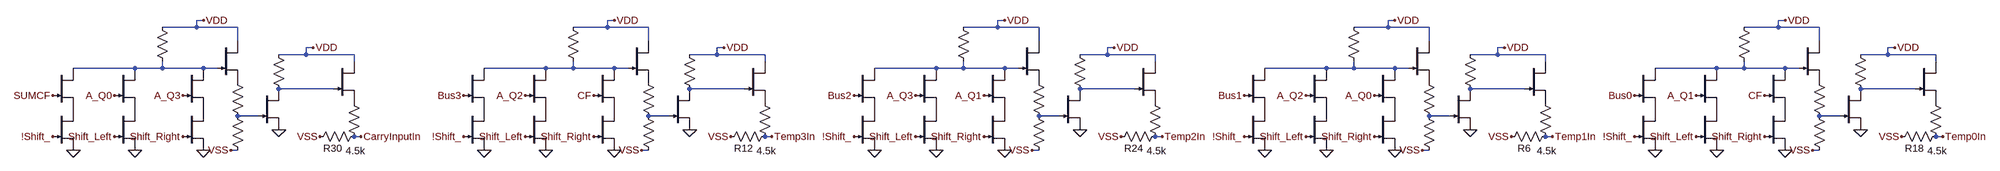
[diagram p0: schematic 4 bit.asc]
4 bit.asc, the LTspice schematic file:
Version 4.1
SHEET 1 109444 42780
WIRE -4192 4224 -4208 4224
WIRE -3232 4224 -3248 4224
WIRE -2320 4224 -2336 4224
WIRE -1408 4224 -1424 4224
WIRE -496 4224 -512 4224
WIRE -4208 4240 -4208 4224
WIRE -4208 4240 -4288 4240
WIRE -4112 4240 -4208 4240
WIRE -3248 4240 -3248 4224
WIRE -3248 4240 -3328 4240
WIRE -3152 4240 -3248 4240
WIRE -2336 4240 -2336 4224
WIRE -2336 4240 -2416 4240
WIRE -2240 4240 -2336 4240
WIRE -1424 4240 -1424 4224
WIRE -1424 4240 -1504 4240
WIRE -1328 4240 -1424 4240
WIRE -512 4240 -512 4224
WIRE -512 4240 -592 4240
WIRE -416 4240 -512 4240
WIRE -4112 4272 -4112 4240
WIRE -3152 4272 -3152 4240
WIRE -2240 4272 -2240 4240
WIRE -1328 4272 -1328 4240
WIRE -416 4272 -416 4240
WIRE -3936 4288 -3952 4288
WIRE -2976 4288 -2992 4288
WIRE -2064 4288 -2080 4288
WIRE -1152 4288 -1168 4288
WIRE -240 4288 -256 4288
WIRE -3952 4304 -3952 4288
WIRE -3952 4304 -4016 4304
WIRE -3840 4304 -3952 4304
WIRE -2992 4304 -2992 4288
WIRE -2992 4304 -3056 4304
WIRE -2880 4304 -2992 4304
WIRE -2080 4304 -2080 4288
WIRE -2080 4304 -2144 4304
WIRE -1968 4304 -2080 4304
WIRE -1168 4304 -1168 4288
WIRE -1168 4304 -1232 4304
WIRE -1056 4304 -1168 4304
WIRE -256 4304 -256 4288
WIRE -256 4304 -320 4304
WIRE -144 4304 -256 4304
WIRE -3840 4320 -3840 4304
WIRE -2880 4320 -2880 4304
WIRE -1968 4320 -1968 4304
WIRE -1056 4320 -1056 4304
WIRE -144 4320 -144 4304
WIRE -4352 4336 -4496 4336
WIRE -4288 4336 -4288 4320
WIRE -4288 4336 -4352 4336
WIRE -4192 4336 -4288 4336
WIRE -4160 4336 -4192 4336
WIRE -3392 4336 -3536 4336
WIRE -3328 4336 -3328 4320
WIRE -3328 4336 -3392 4336
WIRE -3232 4336 -3328 4336
WIRE -3200 4336 -3232 4336
WIRE -2480 4336 -2624 4336
WIRE -2416 4336 -2416 4320
WIRE -2416 4336 -2480 4336
WIRE -2320 4336 -2416 4336
WIRE -2288 4336 -2320 4336
WIRE -1568 4336 -1712 4336
WIRE -1504 4336 -1504 4320
WIRE -1504 4336 -1568 4336
WIRE -1408 4336 -1504 4336
WIRE -1376 4336 -1408 4336
WIRE -656 4336 -800 4336
WIRE -592 4336 -592 4320
WIRE -592 4336 -656 4336
WIRE -496 4336 -592 4336
WIRE -464 4336 -496 4336
WIRE -3888 4384 -4016 4384
WIRE -2928 4384 -3056 4384
WIRE -2016 4384 -2144 4384
WIRE -1104 4384 -1232 4384
WIRE -192 4384 -320 4384
WIRE -4064 4448 -4112 4448
WIRE -3104 4448 -3152 4448
WIRE -2192 4448 -2240 4448
WIRE -1280 4448 -1328 4448
WIRE -368 4448 -416 4448
WIRE -3824 4496 -3840 4496
WIRE -2864 4496 -2880 4496
WIRE -1952 4496 -1968 4496
WIRE -1040 4496 -1056 4496
WIRE -128 4496 -144 4496
WIRE -4112 4528 -4128 4528
WIRE -3152 4528 -3168 4528
WIRE -2240 4528 -2256 4528
WIRE -1328 4528 -1344 4528
WIRE -416 4528 -432 4528
FLAG -2320 4528 0
FLAG -2480 4528 0
FLAG -2144 4480 0
FLAG -2320 4224 VDD
FLAG -2064 4288 VDD
FLAG -2256 4528 VSS
FLAG -2048 4496 VSS
FLAG -2528 4496 Shift_Left
FLAG -2368 4496 Shift_Right
FLAG -2624 4528 0
FLAG -2672 4496 !Shift_
FLAG -2672 4400 Bus2
FLAG -2528 4400 A_Q3
FLAG -4192 4528 0
FLAG -4352 4528 0
FLAG -4016 4480 0
FLAG -4192 4224 VDD
FLAG -3936 4288 VDD
FLAG -4128 4528 VSS
FLAG -3920 4496 VSS
FLAG -4400 4496 Shift_Left
FLAG -4240 4496 Shift_Right
FLAG -4496 4528 0
FLAG -4544 4496 !Shift_
FLAG -4240 4400 A_Q3
FLAG -1952 4496 Temp2In
FLAG -3824 4496 CarryInputIn
FLAG -4544 4400 SUMCF
FLAG -4400 4400 A_Q0
FLAG -1408 4528 0
FLAG -1568 4528 0
FLAG -1232 4480 0
FLAG -1408 4224 VDD
FLAG -1152 4288 VDD
FLAG -1344 4528 VSS
FLAG -1136 4496 VSS
FLAG -1616 4496 Shift_Left
FLAG -1456 4496 Shift_Right
FLAG -1712 4528 0
FLAG -1760 4496 !Shift_
FLAG -1760 4400 Bus1
FLAG -1616 4400 A_Q2
FLAG -1040 4496 Temp1In
FLAG -1456 4400 A_Q0
FLAG -2368 4400 A_Q1
FLAG -496 4528 0
FLAG -656 4528 0
FLAG -320 4480 0
FLAG -496 4224 VDD
FLAG -240 4288 VDD
FLAG -432 4528 VSS
FLAG -224 4496 VSS
FLAG -704 4496 Shift_Left
FLAG -544 4496 Shift_Right
FLAG -800 4528 0
FLAG -848 4496 !Shift_
FLAG -848 4400 Bus0
FLAG -704 4400 A_Q1
FLAG -128 4496 Temp0In
FLAG -544 4400 CF
FLAG -3232 4528 0
FLAG -3392 4528 0
FLAG -3056 4480 0
FLAG -3232 4224 VDD
FLAG -2976 4288 VDD
FLAG -3168 4528 VSS
FLAG -2960 4496 VSS
FLAG -3440 4496 Shift_Left
FLAG -3280 4496 Shift_Right
FLAG -3536 4528 0
FLAG -3584 4496 !Shift_
FLAG -3584 4400 Bus3
FLAG -3440 4400 A_Q2
FLAG -2864 4496 Temp3In
FLAG -3280 4400 CF
SYMBOL njf -2528 4336 R0
WINDOW 3 198 224 Invisible 2
WINDOW 0 56 32 Invisible 2
SYMATTR Value DR
SYMATTR InstName J_A19
SYMBOL res -2432 4224 R0
WINDOW 0 -35 57 Invisible 2
WINDOW 3 34 56 Invisible 2
SYMATTR InstName R19
SYMATTR Value 100k
SYMBOL njf -2288 4272 R0
WINDOW 0 56 32 Invisible 2
WINDOW 3 56 72 Invisible 2
SYMATTR InstName J_F4
SYMATTR Value DR
SYMBOL res -2256 4352 R0
WINDOW 0 -136 215 Invisible 2
WINDOW 3 34 58 Invisible 2
SYMATTR InstName R20
SYMATTR Value 1k
SYMBOL res -2256 4432 R0
WINDOW 0 -10 158 Invisible 2
WINDOW 3 37 62 Invisible 2
SYMATTR InstName R21
SYMATTR Value 4.8k
SYMBOL njf -2368 4336 R0
WINDOW 0 56 32 Invisible 2
WINDOW 3 56 72 Invisible 2
SYMATTR InstName J_B7
SYMATTR Value DR
SYMBOL njf -2192 4384 R0
WINDOW 0 56 32 Invisible 2
WINDOW 3 56 72 Invisible 2
SYMATTR InstName J_A20
SYMATTR Value DR
SYMBOL res -2160 4288 R0
WINDOW 0 56 32 Invisible 2
WINDOW 3 56 72 Invisible 2
SYMATTR InstName R22
SYMATTR Value 50k
SYMBOL njf -2016 4320 R0
WINDOW 0 56 32 Invisible 2
WINDOW 3 56 72 Invisible 2
SYMATTR InstName J_A21
SYMATTR Value DR
SYMBOL res -1984 4400 R0
WINDOW 0 37 24 Invisible 2
WINDOW 3 -30 25 Invisible 2
SYMATTR InstName R23
SYMATTR Value 1k
SYMBOL res -1952 4480 R90
WINDOW 0 59 66 VBottom 2
WINDOW 3 34 13 VTop 2
SYMATTR InstName R24
SYMATTR Value 4.5k
SYMBOL njf -2528 4432 R0
WINDOW 0 119 134 Invisible 2
WINDOW 3 131 136 Invisible 2
SYMATTR InstName J_A22
SYMATTR Value DR
SYMBOL njf -2368 4432 R0
WINDOW 3 -27 143 Invisible 2
WINDOW 0 56 32 Invisible 2
SYMATTR Value DR
SYMATTR InstName J_B8
SYMBOL njf -2672 4336 R0
WINDOW 0 63 15 Invisible 2
WINDOW 3 62 106 Invisible 2
SYMATTR InstName J_A23
SYMATTR Value DR
SYMBOL njf -2672 4432 R0
WINDOW 0 254 138 Invisible 2
WINDOW 3 277 142 Invisible 2
SYMATTR InstName J_A24
SYMATTR Value DR
SYMBOL njf -4400 4336 R0
WINDOW 3 198 224 Invisible 2
WINDOW 0 56 32 Invisible 2
SYMATTR Value DR
SYMATTR InstName J_A25
SYMBOL res -4304 4224 R0
WINDOW 0 -35 57 Invisible 2
WINDOW 3 34 56 Invisible 2
SYMATTR InstName R25
SYMATTR Value 100k
SYMBOL njf -4160 4272 R0
WINDOW 0 56 32 Invisible 2
WINDOW 3 56 72 Invisible 2
SYMATTR InstName J_F5
SYMATTR Value DR
SYMBOL res -4128 4352 R0
WINDOW 0 -136 215 Invisible 2
WINDOW 3 34 58 Invisible 2
SYMATTR InstName R26
SYMATTR Value 1k
SYMBOL res -4128 4432 R0
WINDOW 0 -10 158 Invisible 2
WINDOW 3 37 62 Invisible 2
SYMATTR InstName R27
SYMATTR Value 4.8k
SYMBOL njf -4240 4336 R0
WINDOW 0 56 32 Invisible 2
WINDOW 3 56 72 Invisible 2
SYMATTR InstName J_B9
SYMATTR Value DR
SYMBOL njf -4064 4384 R0
WINDOW 0 56 32 Invisible 2
WINDOW 3 56 72 Invisible 2
SYMATTR InstName J_A26
SYMATTR Value DR
SYMBOL res -4032 4288 R0
WINDOW 0 56 32 Invisible 2
WINDOW 3 56 72 Invisible 2
SYMATTR InstName R28
SYMATTR Value 50k
SYMBOL njf -3888 4320 R0
WINDOW 0 56 32 Invisible 2
WINDOW 3 56 72 Invisible 2
SYMATTR InstName J_A27
SYMATTR Value DR
SYMBOL res -3856 4400 R0
WINDOW 0 37 24 Invisible 2
WINDOW 3 -30 25 Invisible 2
SYMATTR InstName R29
SYMATTR Value 1k
SYMBOL res -3824 4480 R90
WINDOW 0 59 66 VBottom 2
WINDOW 3 34 13 VTop 2
SYMATTR InstName R30
SYMATTR Value 4.5k
SYMBOL njf -4400 4432 R0
WINDOW 0 119 134 Invisible 2
WINDOW 3 131 136 Invisible 2
SYMATTR InstName J_A28
SYMATTR Value DR
SYMBOL njf -4240 4432 R0
WINDOW 3 -27 143 Invisible 2
WINDOW 0 56 32 Invisible 2
SYMATTR Value DR
SYMATTR InstName J_B10
SYMBOL njf -4544 4336 R0
WINDOW 0 63 15 Invisible 2
WINDOW 3 62 106 Invisible 2
SYMATTR InstName J_A29
SYMATTR Value DR
SYMBOL njf -4544 4432 R0
WINDOW 0 254 138 Invisible 2
WINDOW 3 277 142 Invisible 2
SYMATTR InstName J_A30
SYMATTR Value DR
SYMBOL njf -1616 4336 R0
WINDOW 3 198 224 Invisible 2
WINDOW 0 56 32 Invisible 2
SYMATTR Value DR
SYMATTR InstName J_A1
SYMBOL res -1520 4224 R0
WINDOW 0 -35 57 Invisible 2
WINDOW 3 34 56 Invisible 2
SYMATTR InstName R1
SYMATTR Value 100k
SYMBOL njf -1376 4272 R0
WINDOW 0 56 32 Invisible 2
WINDOW 3 56 72 Invisible 2
SYMATTR InstName J_F1
SYMATTR Value DR
SYMBOL res -1344 4352 R0
WINDOW 0 -136 215 Invisible 2
WINDOW 3 34 58 Invisible 2
SYMATTR InstName R2
SYMATTR Value 1k
SYMBOL res -1344 4432 R0
WINDOW 0 -10 158 Invisible 2
WINDOW 3 37 62 Invisible 2
SYMATTR InstName R3
SYMATTR Value 4.8k
SYMBOL njf -1456 4336 R0
WINDOW 0 56 32 Invisible 2
WINDOW 3 56 72 Invisible 2
SYMATTR InstName J_B1
SYMATTR Value DR
SYMBOL njf -1280 4384 R0
WINDOW 0 56 32 Invisible 2
WINDOW 3 56 72 Invisible 2
SYMATTR InstName J_A2
SYMATTR Value DR
SYMBOL res -1248 4288 R0
WINDOW 0 56 32 Invisible 2
WINDOW 3 56 72 Invisible 2
SYMATTR InstName R4
SYMATTR Value 50k
SYMBOL njf -1104 4320 R0
WINDOW 0 56 32 Invisible 2
WINDOW 3 56 72 Invisible 2
SYMATTR InstName J_A3
SYMATTR Value DR
SYMBOL res -1072 4400 R0
WINDOW 0 37 24 Invisible 2
WINDOW 3 -30 25 Invisible 2
SYMATTR InstName R5
SYMATTR Value 1k
SYMBOL res -1040 4480 R90
WINDOW 0 59 66 VBottom 2
WINDOW 3 34 13 VTop 2
SYMATTR InstName R6
SYMATTR Value 4.5k
SYMBOL njf -1616 4432 R0
WINDOW 0 119 134 Invisible 2
WINDOW 3 131 136 Invisible 2
SYMATTR InstName J_A4
SYMATTR Value DR
SYMBOL njf -1456 4432 R0
WINDOW 3 -27 143 Invisible 2
WINDOW 0 56 32 Invisible 2
SYMATTR Value DR
SYMATTR InstName J_B2
SYMBOL njf -1760 4336 R0
WINDOW 0 63 15 Invisible 2
WINDOW 3 62 106 Invisible 2
SYMATTR InstName J_A5
SYMATTR Value DR
SYMBOL njf -1760 4432 R0
WINDOW 0 254 138 Invisible 2
WINDOW 3 277 142 Invisible 2
SYMATTR InstName J_A6
SYMATTR Value DR
SYMBOL njf -704 4336 R0
WINDOW 3 198 224 Invisible 2
WINDOW 0 56 32 Invisible 2
SYMATTR Value DR
SYMATTR InstName J_A13
SYMBOL res -608 4224 R0
WINDOW 0 -35 57 Invisible 2
WINDOW 3 34 56 Invisible 2
SYMATTR InstName R13
SYMATTR Value 100k
SYMBOL njf -464 4272 R0
WINDOW 0 56 32 Invisible 2
WINDOW 3 56 72 Invisible 2
SYMATTR InstName J_F3
SYMATTR Value DR
SYMBOL res -432 4352 R0
WINDOW 0 -136 215 Invisible 2
WINDOW 3 34 58 Invisible 2
SYMATTR InstName R14
SYMATTR Value 1k
SYMBOL res -432 4432 R0
WINDOW 0 -10 158 Invisible 2
WINDOW 3 37 62 Invisible 2
SYMATTR InstName R15
SYMATTR Value 4.8k
SYMBOL njf -544 4336 R0
WINDOW 0 56 32 Invisible 2
WINDOW 3 56 72 Invisible 2
SYMATTR InstName J_B5
SYMATTR Value DR
SYMBOL njf -368 4384 R0
WINDOW 0 56 32 Invisible 2
WINDOW 3 56 72 Invisible 2
SYMATTR InstName J_A14
SYMATTR Value DR
SYMBOL res -336 4288 R0
WINDOW 0 56 32 Invisible 2
WINDOW 3 56 72 Invisible 2
SYMATTR InstName R16
SYMATTR Value 50k
SYMBOL njf -192 4320 R0
WINDOW 0 56 32 Invisible 2
WINDOW 3 56 72 Invisible 2
SYMATTR InstName J_A15
SYMATTR Value DR
SYMBOL res -160 4400 R0
WINDOW 0 37 24 Invisible 2
WINDOW 3 -30 25 Invisible 2
SYMATTR InstName R17
SYMATTR Value 1k
SYMBOL res -128 4480 R90
WINDOW 0 59 66 VBottom 2
WINDOW 3 34 13 VTop 2
SYMATTR InstName R18
SYMATTR Value 4.5k
SYMBOL njf -704 4432 R0
WINDOW 0 119 134 Invisible 2
WINDOW 3 131 136 Invisible 2
SYMATTR InstName J_A16
SYMATTR Value DR
SYMBOL njf -544 4432 R0
WINDOW 3 -27 143 Invisible 2
WINDOW 0 56 32 Invisible 2
SYMATTR Value DR
SYMATTR InstName J_B6
SYMBOL njf -848 4336 R0
WINDOW 0 63 15 Invisible 2
WINDOW 3 62 106 Invisible 2
SYMATTR InstName J_A17
SYMATTR Value DR
SYMBOL njf -848 4432 R0
WINDOW 0 254 138 Invisible 2
WINDOW 3 277 142 Invisible 2
SYMATTR InstName J_A18
SYMATTR Value DR
SYMBOL njf -3440 4336 R0
WINDOW 3 198 224 Invisible 2
WINDOW 0 56 32 Invisible 2
SYMATTR Value DR
SYMATTR InstName J_A7
SYMBOL res -3344 4224 R0
WINDOW 0 -35 57 Invisible 2
WINDOW 3 34 56 Invisible 2
SYMATTR InstName R7
SYMATTR Value 100k
SYMBOL njf -3200 4272 R0
WINDOW 0 56 32 Invisible 2
WINDOW 3 56 72 Invisible 2
SYMATTR InstName J_F2
SYMATTR Value DR
SYMBOL res -3168 4352 R0
WINDOW 0 -136 215 Invisible 2
WINDOW 3 34 58 Invisible 2
SYMATTR InstName R8
SYMATTR Value 1k
SYMBOL res -3168 4432 R0
WINDOW 0 -10 158 Invisible 2
WINDOW 3 37 62 Invisible 2
SYMATTR InstName R9
SYMATTR Value 4.8k
SYMBOL njf -3280 4336 R0
WINDOW 0 56 32 Invisible 2
WINDOW 3 56 72 Invisible 2
SYMATTR InstName J_B3
SYMATTR Value DR
SYMBOL njf -3104 4384 R0
WINDOW 0 56 32 Invisible 2
WINDOW 3 56 72 Invisible 2
SYMATTR InstName J_A8
SYMATTR Value DR
SYMBOL res -3072 4288 R0
WINDOW 0 56 32 Invisible 2
WINDOW 3 56 72 Invisible 2
SYMATTR InstName R10
SYMATTR Value 50k
SYMBOL njf -2928 4320 R0
WINDOW 0 56 32 Invisible 2
WINDOW 3 56 72 Invisible 2
SYMATTR InstName J_A9
SYMATTR Value DR
SYMBOL res -2896 4400 R0
WINDOW 0 37 24 Invisible 2
WINDOW 3 -30 25 Invisible 2
SYMATTR InstName R11
SYMATTR Value 1k
SYMBOL res -2864 4480 R90
WINDOW 0 59 66 VBottom 2
WINDOW 3 34 13 VTop 2
SYMATTR InstName R12
SYMATTR Value 4.5k
SYMBOL njf -3440 4432 R0
WINDOW 0 119 134 Invisible 2
WINDOW 3 131 136 Invisible 2
SYMATTR InstName J_A10
SYMATTR Value DR
SYMBOL njf -3280 4432 R0
WINDOW 3 -27 143 Invisible 2
WINDOW 0 56 32 Invisible 2
SYMATTR Value DR
SYMATTR InstName J_B4
SYMBOL njf -3584 4336 R0
WINDOW 0 63 15 Invisible 2
WINDOW 3 62 106 Invisible 2
SYMATTR InstName J_A11
SYMATTR Value DR
SYMBOL njf -3584 4432 R0
WINDOW 0 254 138 Invisible 2
WINDOW 3 277 142 Invisible 2
SYMATTR InstName J_A12
SYMATTR Value DR

The netlist it stands for:
* 4 bit.asc
J_A19 N003 A_Q3 P001 DR
R19 VDD N003 100k
J_F4 VDD N003 P002 DR
R20 P002 N013 1k
R21 N013 VSS 4.8k
J_B7 N003 A_Q1 P003 DR
J_A20 N008 N013 0 DR
R22 VDD N008 50k
J_A21 VDD N008 P004 DR
R23 P004 Temp2In 1k
R24 Temp2In VSS 4.5k
J_A22 P001 Shift_Left 0 DR
J_B8 P003 Shift_Right 0 DR
J_A23 N003 Bus2 P005 DR
J_A24 P005 !Shift_ 0 DR
J_A25 N001 A_Q0 P006 DR
R25 VDD N001 100k
J_F5 VDD N001 P007 DR
R26 P007 N011 1k
R27 N011 VSS 4.8k
J_B9 N001 A_Q3 P008 DR
J_A26 N006 N011 0 DR
R28 VDD N006 50k
J_A27 VDD N006 P009 DR
R29 P009 CarryInputIn 1k
R30 CarryInputIn VSS 4.5k
J_A28 P006 Shift_Left 0 DR
J_B10 P008 Shift_Right 0 DR
J_A29 N001 SUMCF P010 DR
J_A30 P010 !Shift_ 0 DR
J_A1 N004 A_Q2 P011 DR
R1 VDD N004 100k
J_F1 VDD N004 P012 DR
R2 P012 N014 1k
R3 N014 VSS 4.8k
J_B1 N004 A_Q0 P013 DR
J_A2 N009 N014 0 DR
R4 VDD N009 50k
J_A3 VDD N009 P014 DR
R5 P014 Temp1In 1k
R6 Temp1In VSS 4.5k
J_A4 P011 Shift_Left 0 DR
J_B2 P013 Shift_Right 0 DR
J_A5 N004 Bus1 P015 DR
J_A6 P015 !Shift_ 0 DR
J_A13 N005 A_Q1 P016 DR
R13 VDD N005 100k
J_F3 VDD N005 P017 DR
R14 P017 N015 1k
R15 N015 VSS 4.8k
J_B5 N005 CF P018 DR
J_A14 N010 N015 0 DR
R16 VDD N010 50k
J_A15 VDD N010 P019 DR
R17 P019 Temp0In 1k
R18 Temp0In VSS 4.5k
J_A16 P016 Shift_Left 0 DR
J_B6 P018 Shift_Right 0 DR
J_A17 N005 Bus0 P020 DR
J_A18 P020 !Shift_ 0 DR
J_A7 N002 A_Q2 P021 DR
R7 VDD N002 100k
J_F2 VDD N002 P022 DR
R8 P022 N012 1k
R9 N012 VSS 4.8k
J_B3 N002 CF P023 DR
J_A8 N007 N012 0 DR
R10 VDD N007 50k
J_A9 VDD N007 P024 DR
R11 P024 Temp3In 1k
R12 Temp3In VSS 4.5k
J_A10 P021 Shift_Left 0 DR
J_B4 P023 Shift_Right 0 DR
J_A11 N002 Bus3 P025 DR
J_A12 P025 !Shift_ 0 DR
.model NJF NJF
.model PJF PJF
.lib standard.jft
.backanno
.end